# Altium schematic sheet Sheet1.SchDoc
size B; SheetNumber: 1; SheetTotal: 4
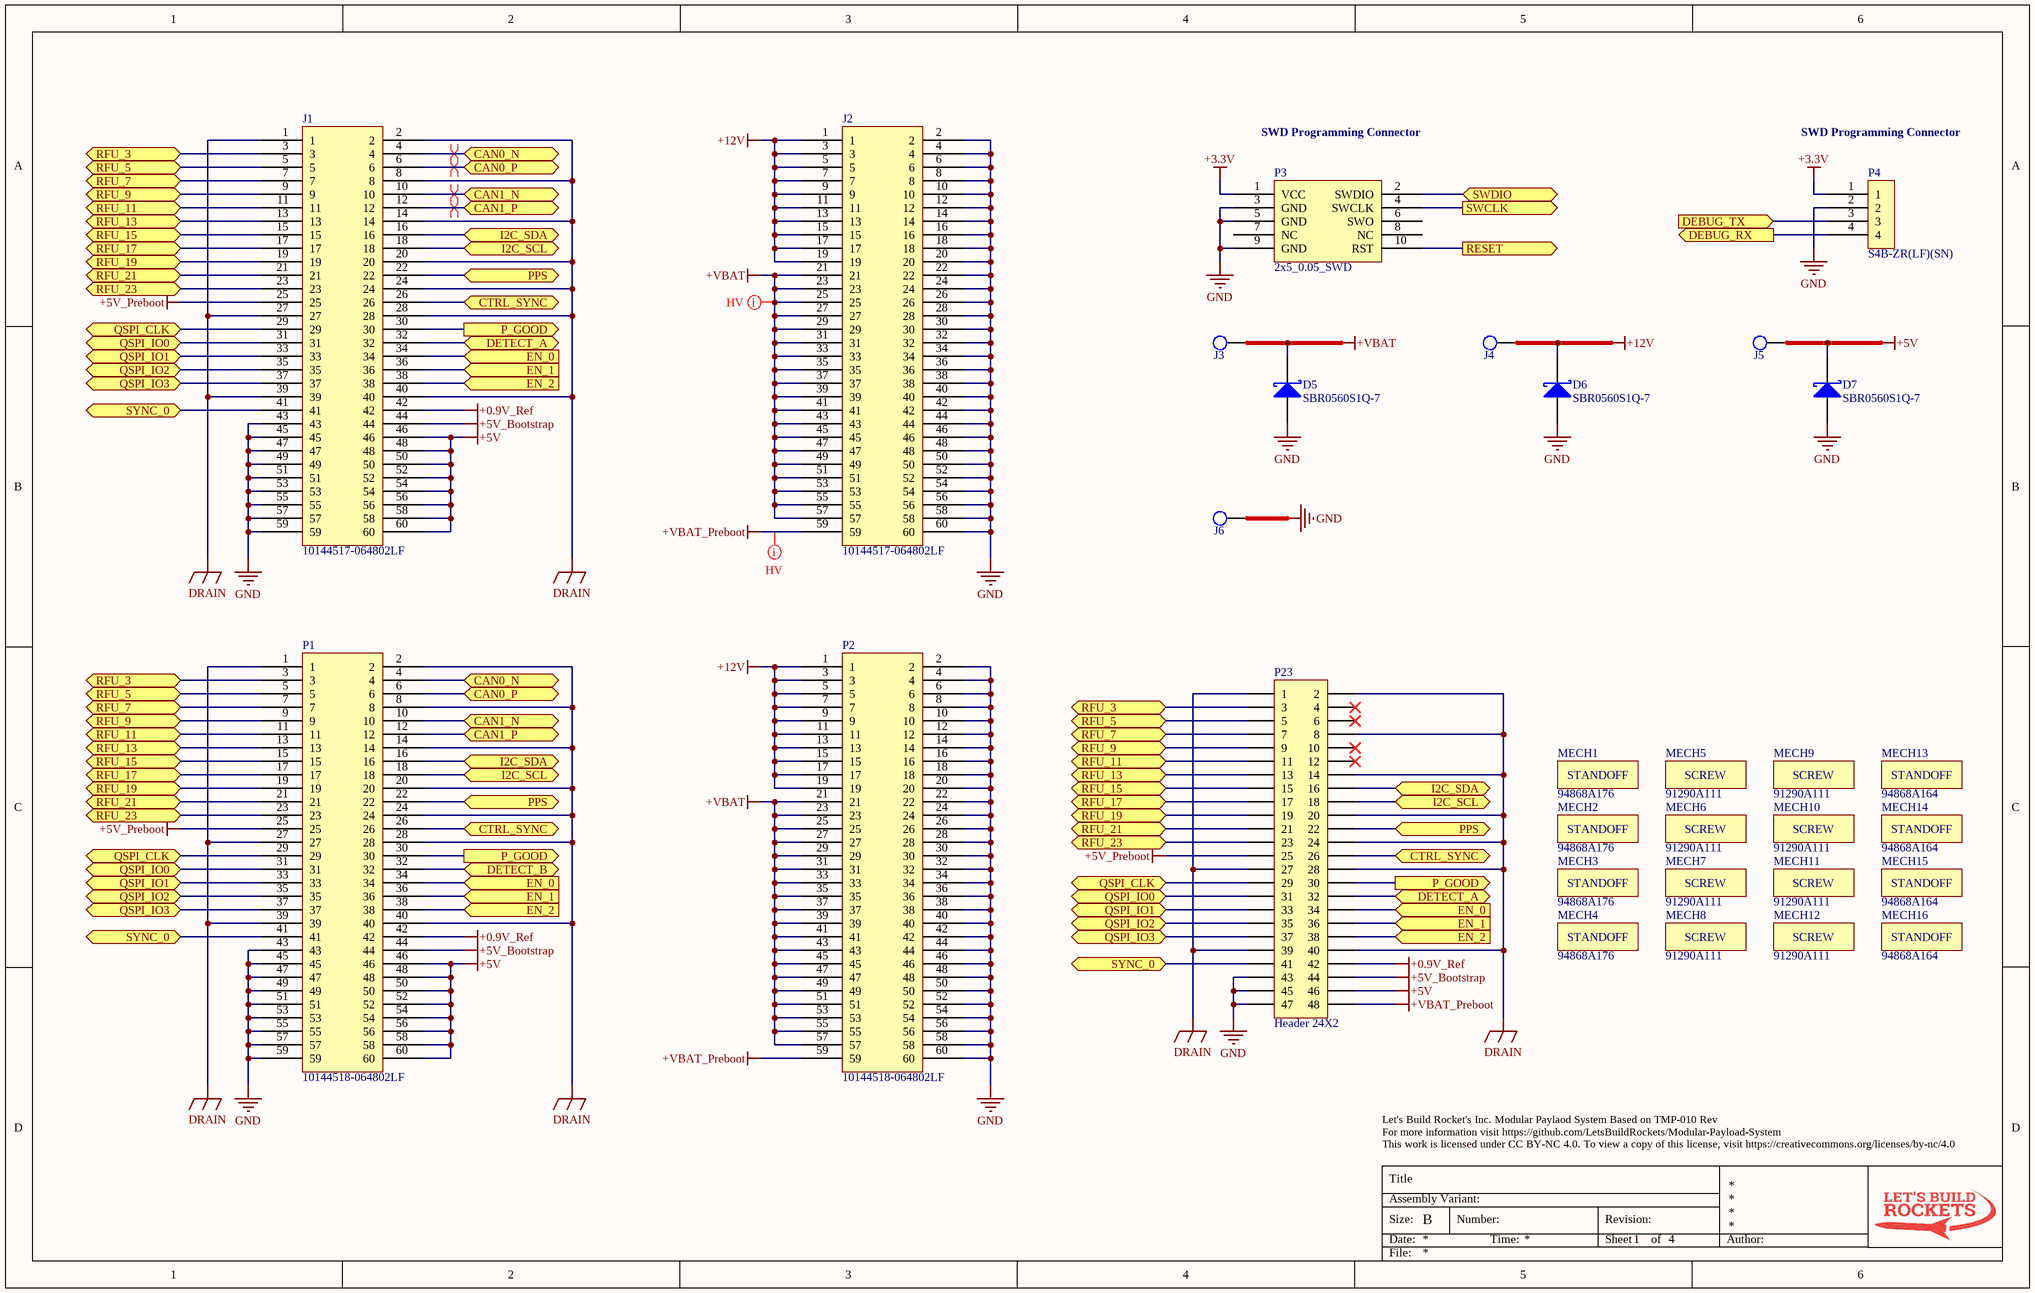
[diagram p0: Sheet1.SchDoc]

## Parts
D5  SBR0560S1Q-7  [SOD123]
D6  SBR0560S1Q-7  [SOD123]
D7  SBR0560S1Q-7  [SOD123]
J1  10144517-064802LF  [10144517-064802LF]
J2  10144517-064802LF  [10144517-064802LF]
J3  Banana  [CT3151SP-2]  (value not drawn)
J4  Banana  [CT3151SP-2]  (value not drawn)
J5  Banana  [CT3151SP-2]  (value not drawn)
J6  Banana  [CT3151SP-0]  (value not drawn)
MECH1  94868A176  [94868A176]
MECH2  94868A176  [94868A176]
MECH3  94868A176  [94868A176]
MECH4  94868A176  [94868A176]
MECH5  91290A111  [91290A111]
MECH6  91290A111  [91290A111]
MECH7  91290A111  [91290A111]
MECH8  91290A111  [91290A111]
MECH9  91290A111  [91290A111]
MECH10  91290A111  [91290A111]
MECH11  91290A111  [91290A111]
MECH12  91290A111  [91290A111]
MECH13  94868A164  [94868A164]
MECH14  94868A164  [94868A164]
MECH15  94868A164  [94868A164]
MECH16  94868A164  [94868A164]
P1  10144518-064802LF  [10144518-064802LF]
P2  10144518-064802LF  [10144518-064802LF]
P3  2x5_0.05_SWD  [2x5_0.05_R]
P4  S4B-ZR(LF)(SN)  [S4B-ZR(LF)(SN)]
P23  Header 24X2  [HDR2X24]  (no BOM)

## Ports
CAN0_N (bidir), CAN0_P (bidir), CAN1_N (bidir), CAN1_P (bidir), CTRL_SYNC (bidir), DEBUG_RX (out), DEBUG_TX (in), DETECT_A (bidir), DETECT_B (bidir), EN_0 (in), EN_1 (in), EN_2 (in), I2C_SCL (bidir), I2C_SDA (bidir), P_GOOD (out), PPS (bidir), QSPI_CLK (bidir), QSPI_IO0 (bidir), QSPI_IO1 (bidir), QSPI_IO2 (bidir), QSPI_IO3 (bidir), RESET (out), RFU_3 (bidir), RFU_5 (bidir), RFU_7 (bidir), RFU_9 (bidir), RFU_11 (bidir), RFU_13 (bidir), RFU_15 (bidir), RFU_17 (bidir), RFU_19 (bidir), RFU_21 (bidir), RFU_23 (bidir), SWCLK (out), SWDIO (bidir), SYNC_0 (bidir)

## Nets
+0.9V_Ref: J1.42 P1.42 P23.42
+3.3V: P3.1(VCC) P4.1
+5V: D7.K J1.46 J1.48 J1.50 J1.52 J1.54 J1.56 J1.58 J1.60 J5.1 P1.46 P1.48 P1.50 P1.52 P1.54 P1.56 P1.58 P1.60 P23.46
+5V_Bootstrap: J1.44 P1.44 P23.44
+5V_Preboot: J1.25 P1.25 P23.25
+12V: D6.K J2.1 J2.3 J2.5 J2.7 J2.9 J2.11 J2.13 J2.15 J2.17 J2.19 J4.1 P2.1 P2.3 P2.5 P2.7 P2.9 P2.11 P2.13 P2.15 P2.17 P2.19
+VBAT: D5.K J2.21 J2.23 J2.25 J2.27 J2.29 J2.31 J2.33 J2.35 J2.37 J2.39 J2.41 J2.43 J2.45 J2.47 J2.49 J2.51 J2.53 J2.55 J2.57 J3.1 P2.21 P2.23 P2.25 P2.27 P2.29 P2.31 P2.33 P2.35 P2.37 P2.39 P2.41 P2.43 P2.45 P2.47 P2.49 P2.51 P2.53 P2.55 P2.57
+VBAT_Preboot: J2.59 P2.59 P23.48
DRAIN: J1.1 J1.2 J1.8 J1.14 J1.20 J1.24 J1.27 J1.28 J1.39 J1.40 P1.1 P1.2 P1.8 P1.14 P1.20 P1.24 P1.27 P1.28 P1.39 P1.40 P23.1 P23.2 P23.8 P23.14 P23.20 P23.24 P23.27 P23.28 P23.39 P23.40
GND: D5.A D6.A D7.A J1.43 J1.45 J1.47 J1.49 J1.51 J1.53 J1.55 J1.57 J1.59 J2.2 J2.4 J2.6 J2.8 J2.10 J2.12 J2.14 J2.16 J2.18 J2.20 J2.22 J2.24 J2.26 J2.28 J2.30 J2.32 J2.34 J2.36 J2.38 J2.40 J2.42 J2.44 J2.46 J2.48 J2.50 J2.52 J2.54 J2.56 J2.58 J2.60 J6.1 P1.43 P1.45 P1.47 P1.49 P1.51 P1.53 P1.55 P1.57 P1.59 P2.2 P2.4 P2.6 P2.8 P2.10 P2.12 P2.14 P2.16 P2.18 P2.20 P2.22 P2.24 P2.26 P2.28 P2.30 P2.32 P2.34 P2.36 P2.38 P2.40 P2.42 P2.44 P2.46 P2.48 P2.50 P2.52 P2.54 P2.56 P2.58 P2.60 P3.3(GND) P3.5(GND) P3.9(GND) P4.2 P23.43 P23.45 P23.47
CAN0_N: J1.4 P1.4 ; port CAN0_N
CAN0_P: J1.6 P1.6 ; port CAN0_P
CAN1_N: J1.10 P1.10 ; port CAN1_N
CAN1_P: J1.12 P1.12 ; port CAN1_P
CTRL_SYNC: J1.26 P1.26 P23.26 ; port CTRL_SYNC
DEBUG_RX: P4.4 ; port DEBUG_RX
DEBUG_TX: P4.3 ; port DEBUG_TX
DETECT_A: J1.32 P23.32 ; port DETECT_A
DETECT_B: P1.32 ; port DETECT_B
EN_0: J1.34 P1.34 P23.34 ; port EN_0
EN_1: J1.36 P1.36 P23.36 ; port EN_1
EN_2: J1.38 P1.38 P23.38 ; port EN_2
I2C_SCL: J1.18 P1.18 P23.18 ; port I2C_SCL
I2C_SDA: J1.16 P1.16 P23.16 ; port I2C_SDA
P_GOOD: J1.30 P1.30 P23.30 ; port P_GOOD
PPS: J1.22 P1.22 P23.22 ; port PPS
QSPI_CLK: J1.29 P1.29 P23.29 ; port QSPI_CLK
QSPI_IO0: J1.31 P1.31 P23.31 ; port QSPI_IO0
QSPI_IO1: J1.33 P1.33 P23.33 ; port QSPI_IO1
QSPI_IO2: J1.35 P1.35 P23.35 ; port QSPI_IO2
QSPI_IO3: J1.37 P1.37 P23.37 ; port QSPI_IO3
RESET: P3.10(RST) ; port RESET
RFU_3: J1.3 P1.3 P23.3 ; port RFU_3
RFU_5: J1.5 P1.5 P23.5 ; port RFU_5
RFU_7: J1.7 P1.7 P23.7 ; port RFU_7
RFU_9: J1.9 P1.9 P23.9 ; port RFU_9
RFU_11: J1.11 P1.11 P23.11 ; port RFU_11
RFU_13: J1.13 P1.13 P23.13 ; port RFU_13
RFU_15: J1.15 P1.15 P23.15 ; port RFU_15
RFU_17: J1.17 P1.17 P23.17 ; port RFU_17
RFU_19: J1.19 P1.19 P23.19 ; port RFU_19
RFU_21: J1.21 P1.21 P23.21 ; port RFU_21
RFU_23: J1.23 P1.23 P23.23 ; port RFU_23
SWCLK: P3.4(SWCLK) ; port SWCLK
SWDIO: P3.2(SWDIO) ; port SWDIO
SYNC_0: J1.41 P1.41 P23.41 ; port SYNC_0

Not connected (* = marked no-connect by the designer): P3 6(SWO) 7(NC) 8(NC); P23 4* 6* 10* 12*

## Layout directives
differential pair; differential pair class CAN: CAN0_N, CAN0_P, CAN1_N, CAN1_P
net class HIghVoltage: +VBAT, +VBAT_Preboot

## Notes on the sheet
- SWD Programming Connector
- Let's Build Rocket's Inc. Modular Paylaod System Based on TMP-010 Rev
  For more information visit https://github.com/LetsBuildRockets/Modular-Payload-System
  This work is licensed under CC BY-NC 4.0. To view a copy of this license, visit https://creativecommons.org/licenses/by-nc/4.0
- Title
- Size:
- Date:
- Assembly Variant:
- B
- Number:
- Time:
- Revision:
- Sheet
- of
- Author:
- File:
- (in symbol 91290A111) SCREW
- (in symbol 94868A164) STANDOFF
- (in symbol 94868A176) STANDOFF

## Library data of the parts
D5-D7 = SBR0560S1Q-7: Unit Price (USD): 0.37
J1 J2 = 10144517-064802LF: Unit Price (USD): 1.95
J3-J5 = CT3151SP-2: Unit Price (USD): 2.05
J6 = CT3151SP-0: Unit Price (USD): 2.05
MECH1-MECH4 = 94868A176: Unit Price (USD): 1.32
MECH5-MECH12 = 91290A111: Unit Price (USD): 0.0871
MECH13-MECH16 = 94868A164: Unit Price (USD): 1..10
P1 P2 = 10144518-064802LF: Unit Price (USD): 1.52
P3 = 2x5_0.05_SWD: Unit Price (USD): 0.75
P4 = S4B-ZR(LF)(SN): Unit Price (USD): 0.24
P23 = Header 24X2: Header, 24-Pin, Dual row; LatestRevisionDate: 17-Jul-2002; LatestRevisionNote: Re-released for DXP Platform.; Publisher: Altium Limited